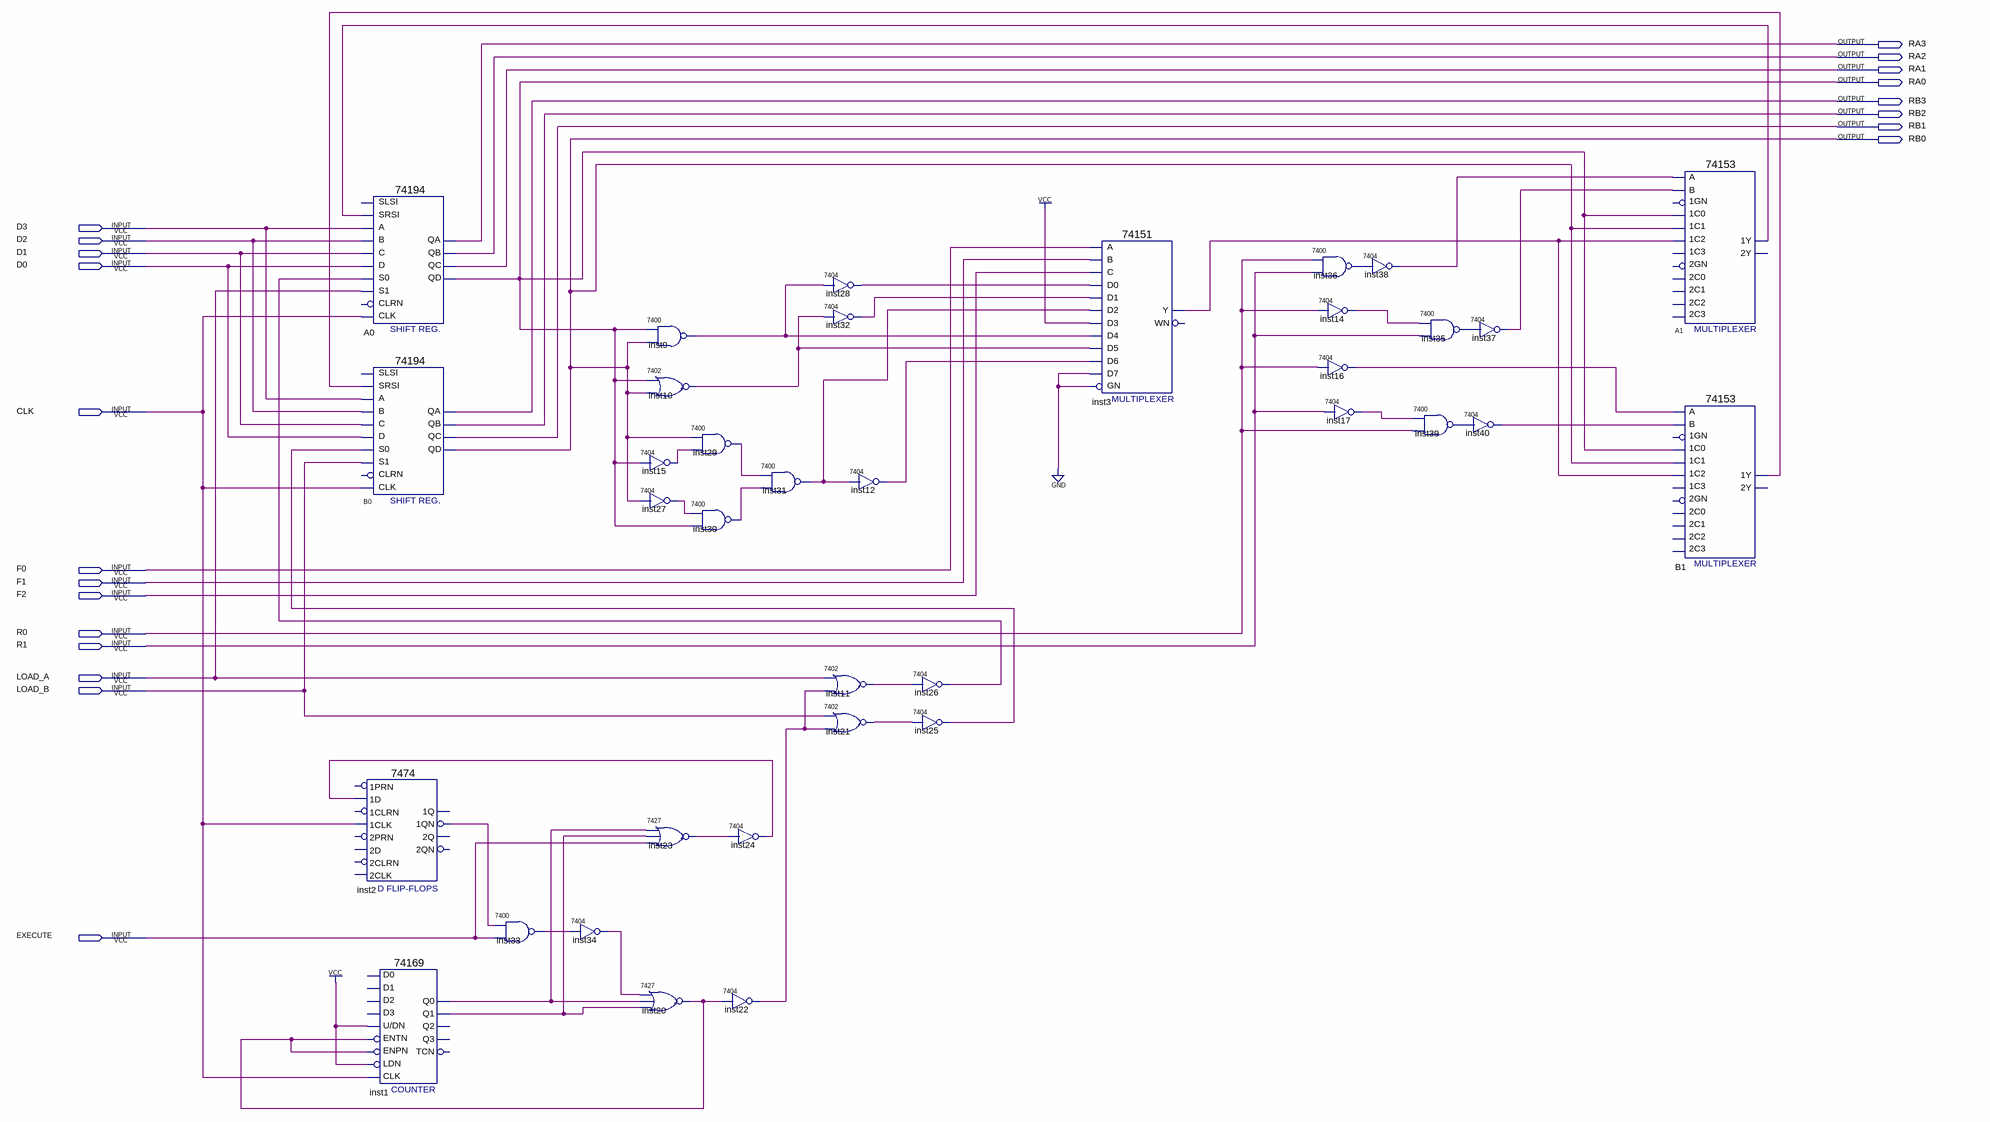
[diagram p0: schematic sheet]
// Quartus schematic lab3yy.bdf as structural Verilog: 36 symbols, 21 pins
module lab3yy (
  input  D3,
  input  D2,
  input  D1,
  input  D0,
  input  CLK,
  input  F0,
  input  F1,
  input  F2,
  input  R0,
  input  R1,
  input  LOAD_A,
  input  LOAD_B,
  input  EXECUTE,
  output RA3,
  output RA2,
  output RA1,
  output RA0,
  output RB3,
  output RB2,
  output RB1,
  output RB0
);

  wire A1_1y, B1_1y, inst1_q0, inst1_q1, inst2_1qn, inst3_y, inst9_1, inst10_1, inst11_1, inst12_1, inst14_1,
       inst15_1, inst16_1, inst17_1, inst20_1, inst21_1, inst22_1, inst23_1, inst24_1, inst25_1, inst26_1,
       inst27_1, inst28_1, inst29_1, inst30_1, inst31_1, inst32_1, inst33_1, inst34_1, inst35_1, inst36_1,
       inst37_1, inst38_1, inst39_1, inst40_1;

  \7474  inst2 (
    .\1CLK (CLK), .\1D (inst24_1), .\1QN (inst2_1qn));  // open: 2D, 2PRN, 1PRN, 2CLK, 2CLRN, 1CLRN, 2Q, 2QN, 1Q
  \74194  A0 (
    .SRSI(A1_1y), .B(D2), .C(D1), .CLK(CLK), .D(D0), .S1(LOAD_A), .S0(inst26_1), .A(D3), .QA(RA3), .QB(RA2),
    .QC(RA1), .QD(RA0));  // open: SLSI, CLRN
  \74194  B0 (
    .SRSI(B1_1y), .B(D2), .C(D1), .CLK(CLK), .D(D0), .S1(LOAD_B), .S0(inst25_1), .A(D3), .QA(RB3), .QB(RB2),
    .QC(RB1), .QD(RB0));  // open: SLSI, CLRN
  \74169  inst1 (
    .ENTN(inst20_1), .\U/DN (1'b1), .LDN(1'b1), .CLK(CLK), .ENPN(inst20_1), .Q1(inst1_q1), .Q0(inst1_q0));  // open: D1, D2, D0, D3, Q2, TCN, Q3
  \7400  inst33 (.\3 (EXECUTE), .\2 (inst2_1qn), .\1 (inst33_1));
  \7404  inst34 (.\2 (inst33_1), .\1 (inst34_1));
  \7400  inst9 (.\3 (RB0), .\2 (RA0), .\1 (inst9_1));
  \7402  inst10 (.\2 (RA0), .\3 (RB0), .\1 (inst10_1));
  \7404  inst15 (.\2 (RA0), .\1 (inst15_1));
  \7404  inst27 (.\2 (RB0), .\1 (inst27_1));
  \7427  inst23 (.\4 (EXECUTE), .\3 (inst1_q1), .\2 (inst1_q0), .\1 (inst23_1));
  \7427  inst20 (.\4 (inst1_q1), .\3 (inst1_q0), .\2 (inst34_1), .\1 (inst20_1));
  \7400  inst29 (.\3 (inst15_1), .\2 (RB0), .\1 (inst29_1));
  \7400  inst30 (.\3 (RA0), .\2 (inst27_1), .\1 (inst30_1));
  \7400  inst31 (.\3 (inst30_1), .\2 (inst29_1), .\1 (inst31_1));
  \7404  inst24 (.\2 (inst23_1), .\1 (inst24_1));
  \7404  inst22 (.\2 (inst20_1), .\1 (inst22_1));
  \7404  inst28 (.\2 (inst9_1), .\1 (inst28_1));
  \7404  inst32 (.\2 (inst10_1), .\1 (inst32_1));
  \7404  inst12 (.\2 (inst31_1), .\1 (inst12_1));
  \7402  inst11 (.\2 (LOAD_A), .\3 (inst22_1), .\1 (inst11_1));
  \7402  inst21 (.\2 (LOAD_B), .\3 (inst22_1), .\1 (inst21_1));
  \7404  inst26 (.\2 (inst11_1), .\1 (inst26_1));
  \7404  inst25 (.\2 (inst21_1), .\1 (inst25_1));
  \74151  inst3 (
    .GN(1'b0), .C(F2), .B(F1), .A(F0), .D5(inst10_1), .D0(inst28_1), .D1(inst32_1), .D4(inst9_1), .D3(1'b1),
    .D2(inst31_1), .D6(inst12_1), .D7(1'b0), .Y(inst3_y));  // open: WN
  \7400  inst36 (.\3 (R1), .\2 (R0), .\1 (inst36_1));
  \7404  inst14 (.\2 (R0), .\1 (inst14_1));
  \7404  inst16 (.\2 (R0), .\1 (inst16_1));
  \7404  inst38 (.\2 (inst36_1), .\1 (inst38_1));
  \7404  inst17 (.\2 (R1), .\1 (inst17_1));
  \7400  inst35 (.\3 (R1), .\2 (inst14_1), .\1 (inst35_1));
  \7400  inst39 (.\3 (R0), .\2 (inst17_1), .\1 (inst39_1));
  \7404  inst37 (.\2 (inst35_1), .\1 (inst37_1));
  \7404  inst40 (.\2 (inst39_1), .\1 (inst40_1));
  \74153  A1 (
    .\1C1 (RB0), .\1C0 (RA0), .\1C2 (inst3_y), .B(inst37_1), .A(inst38_1), .\1Y (A1_1y));  // open: 1GN, 2C0, 2GN, 2C2, 1C3, 2C1, 2C3, 2Y
  \74153  B1 (
    .\1C1 (RB0), .\1C0 (RA0), .\1C2 (inst3_y), .B(inst40_1), .A(inst16_1), .\1Y (B1_1y));  // open: 1GN, 2C0, 2GN, 2C2, 1C3, 2C1, 2C3, 2Y
endmodule
